# Altium project lab_2_pankov_boost.PrjPcb
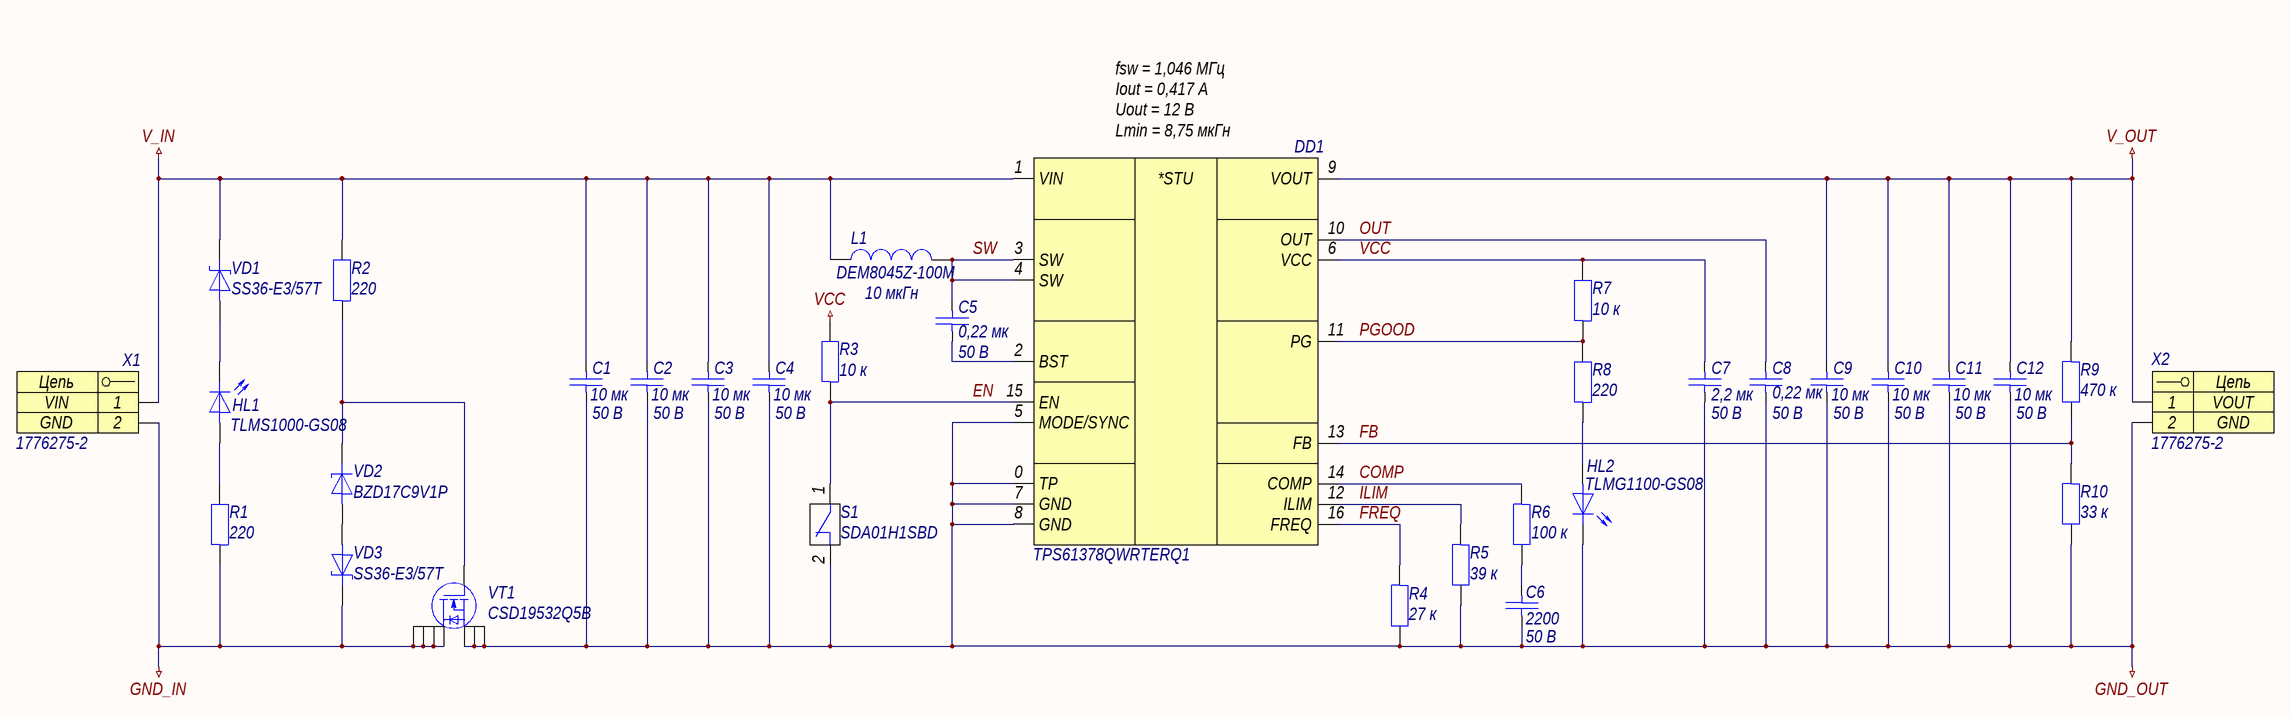
[diagram p0: lab_2_pankov_boost.SchDoc]
check: Капустин Д.А.; designation: СПБПУ.3331506.019; developer: Паньков И.С.; document_code: Ý3; document_type: Схема электрическая принципиальная; pcb_dec_number: СПБПУ.3331506.019; project: Преобразователь напряжения; sheets_total: 1; title: Лабораторная работа №2 — Преобразователь напряжения; title_line_1: Преобразователь; title_line_2: напряжения
1 sheet, 33 parts. Net scope: global (net labels, ports and power ports of the same name join across sheets).
Board file: lab_2_pankov_boost.PcbDoc

## Sheet lab_2_pankov_boost.SchDoc: Лабораторная работа №2 — Преобразователь напряжения
size 594 x 420 mm; CheckedBy: Капустин Д.А.; DrawnBy: Паньков И.С.; DocumentNumber: СПБПУ.3331506.019Ý3; SheetNumber: 1; SheetTotal: 1; DocumentCode: Ý3; ImagePath: СПБПУ.3331506.019

### Parts
C1  10 мк  Напряжение: 50 В  [C0805]
C2  10 мк  Напряжение: 50 В  [C0805]
C3  10 мк  Напряжение: 50 В  [C0805]
C4  10 мк  Напряжение: 50 В  [C0805]
C5  0,22 мк  Напряжение: 50 В  [C0603]
C6  2200  Напряжение: 50 В  [C0603]
C7  2,2 мк  Напряжение: 50 В  [C0603]
C8  0,22 мк  Напряжение: 50 В  [C0603]
C9  10 мк  Напряжение: 50 В  [C0805]
C10  10 мк  Напряжение: 50 В  [C0805]
C11  10 мк  Напряжение: 50 В  [C0805]
C12  10 мк  Напряжение: 50 В  [C0805]
DD1  TPS61378QWRTERQ1  [QFN-16-3X3]
HL1  TLMS1000-GS08  [HL0603]
HL2  TLMG1100-GS08  [HL0603]
L1  DEM8045Z-100M  Индуктивность: 10 мкГн  [DEM-2-800X800X450]
R1  220  [R0603]
R2  220  [R0603]
R3  10 к  [R0603]
R4  27 к  [R0603]
R5  39 к  [R0603]
R6  100 к  [R0603]
R7  10 к  [R0603]
R8  220  [R0603]
R9  470 к  [R0603]
R10  33 к  [R0603]
S1  SDA01H1SBD  [DIP-SWITCH-01-452X930X545]
VD1  SS36-E3/57T  [DO-214AB]
VD2  BZD17C9V1P  [DO-219AB]
VD3  SS36-E3/57T  [DO-214AB]
VT1  CSD19532Q5B  [SON-8]
X1  1776275-2  [1776275-2]
X2  1776275-2  [1776275-2]

### Nets
GND_IN: R1.1 VD3.1 VT1.D X1.2
GND_OUT: C1.2 C2.2 C3.2 C4.2 C6.1 C7.2 C8.2 C9.2 C10.2 C11.2 C12.2 DD1.0(TP) DD1.5(MODE/SYNC) DD1.7(GND) DD1.8(GND) HL2.1 R4.2 R5.2 R10.2 S1.2 VT1.S X2.2
V_IN: C1.1 C2.1 C3.1 C4.1 DD1.1(VIN) L1.1 R2.2 VD1.1 X1.1
V_OUT: C9.1 C10.1 C11.1 C12.1 DD1.9(VOUT) R9.1 X2.1
VCC: C7.1 DD1.6(VCC) R3.2 R7.2
COMP: DD1.14(COMP) R6.1
EN: DD1.15(EN) R3.1 S1.1
FB: DD1.13(FB) R9.2 R10.1
FREQ: DD1.16(FREQ) R4.1
ILIM: DD1.12(ILIM) R5.1
OUT: C8.1 DD1.10(OUT)
PGOOD: DD1.11(PG) R7.1 R8.2
SW: C5.1 DD1.3(SW) DD1.4(SW) L1.2
NetC5_2: C5.2 DD1.2(BST)
NetC6_2: C6.2 R6.2
NetHL1_1: HL1.1 VD1.2
NetHL1_2: HL1.2 R1.2
NetHL2_2: HL2.2 R8.1
NetR2_1: R2.1 VD2.1 VT1.G
NetVD2_2: VD2.2 VD3.2

### Notes on the sheet
- (near DD1) fsw = 1,046 МГц
  Iout = 0,417 А
  Uout = 12 В
  Lmin = 8,75 мкГн
- Перв. примен.
- Справ. №
- Подп. и дата
- Инв. № дубл.
- Нормоконтроль:
- Взам. инв. №
- Изм.
- Лист
- № докум.
- Подп.
- Дата
- Лит.
- Масса
- Масштаб
- Т.контр.
- Пров.
- Разраб.
- Листов
- Разработал:
- Инв. № подл.
- Н.контр.
- Утв.
- Копировал
- Формат
- А2
- (in symbol dd0001) *STU
- (in symbol x0005) Цепь

### Library data of the parts
C1-C4 C9-C12 = c0091: =Описание; ID: c0091; Фамилия: Паньков; Описание: Конденсатор чип 0805 10 мкФ 50 В ±10 %; Наименование: CC0805KRX5R9BB106; Производитель: YAGEO Corp.; Отклонение: ±10 %; Рабочие температуры: от –55 °С до +85 °С; Температурный коэффициент емкости: X5R; Корпус: 0805; Номинал: 10 мк; Номинальное напряжение: 50 В; HelpURL: https://www.yageo.com/upload/media/product/productsearch/datasheet/mlcc/UPY-GPHC_X5R_4V-to-50V_26.pdf
C5 C8 = c0041: =Описание; ID: c0041; Фамилия: Паньков; Описание: Конденсатор чип 0603 220 нФ 50 В ±10 %; Наименование: CC0603KRX5R9BB224; Производитель: YAGEO Corp.; Отклонение: ±10 %; Рабочие температуры: от –55 °С до +85 °С; Температурный коэффициент емкости: X5R; Корпус: 0603; Номинал: 0,22 мк; Номинальное напряжение: 50 В; HelpURL: https://www.yageo.com/upload/media/product/productsearch/datasheet/mlcc/UPY-GPHC_X5R_4V-to-50V_26.pdf
C6 = c0019: =Описание; ID: c0019; Фамилия: Паньков; Описание: Конденсатор чип 0603 2,2 нФ 50 В ±10 %; Наименование: CC0603KRX7R9BB222; Производитель: YAGEO Corp.; Отклонение: ±10 %; Рабочие температуры: от –55 °С до +125 °С; Температурный коэффициент емкости: X7R; Корпус: 0603; Номинал: 2200; Номинальное напряжение: 50 В; HelpURL: https://www.yageo.com/upload/media/product/products/datasheet/mlcc/UPY-GPHC_X7R_6.3V-to-50V_20.pdf
C7 = c0071: =Описание; ID: c0071; Фамилия: Самарин; Описание: Конденсатор чип 0603 2,2 мкФ 50 В ±10 %; Наименование: CC0603KRX5R9BB225; Производитель: YAGEO Corp.; Отклонение: ±10 %; Рабочие температуры: от –55 °С до +85 °С; Температурный коэффициент емкости: X5R; Корпус: 0603; Номинал: 2,2 мк; Номинальное напряжение: 50 В; HelpURL: https://www.yageo.com/upload/media/product/productsearch/datasheet/mlcc/UPY-GPHC_X5R_4V-to-50V_26.pdf
DD1 = dd0001: =Описание; ID: dd0001; Фамилия: Паньков; Описание: Повышающий преобразователь напряжения 18,5 В и 4,8 А; Производитель: Texas Instruments; Входное напряжение: от 2,3 В до 14 В; Выходное напряжение: от 4 В до 18,5 В; Коммутируемый ток: от 1 А до 4,8 А; Частота переключения: от 200 кГц до 2,2 МГц; Рабочие температуры: от -40 °С до +125 °С; Корпус: QFN-16 (3 x 3); Наименование: TPS61378QWRTERQ1; HelpURL: https://www.ti.com/product/TPS61378-Q1
HL1 = hl0001: =Описание; ID: hl0001; Фамилия: Ларионов; Описание: Светодиод чип 0603 красный; Производитель: Vishay Intertechnology, Inc.; Цвет: Red; Номинальная сила света: 4 мкд; Номинальная длина волны: 628 нм; Номинальный прямой ток: 15 мА; Номинальное падение напряжения: 1,8 В; Рассеиваемая мощность: 40 мВт; Рабочие температуры: от -40 °С до +100 °С; Корпус: 0603; Наименование: TLMS1000-GS08; HelpURL: https://www.vishay.com/leds/list/product-83172/
HL2 = hl0005: =Описание; ID: hl0005; Фамилия: Ларионов; Описание: Светодиод чип 0603 зеленый; Производитель: Vishay Intertechnology, Inc.; Цвет: Green; Номинальная сила света: 35 мкд; Номинальная длина волны: 570 нм; Номинальный прямой ток: 30 мА; Номинальное падение напряжения: 2,1 В; Рассеиваемая мощность: 90 мВт; Рабочие температуры: от -40 °С до +100 °С; Корпус: 0603; Наименование: TLMG1100-GS08; HelpURL: https://www.vishay.com/leds/list/product-83173/
L1 = l0005: =Описание; ID: l0005; Фамилия: Паньков; Описание: Катушка индуктивности 10 мкГн ±20 %; Производитель: Murata Manufacturing Co., Ltd.; Отклонение: ±20 %; Номинальное активное сопротивление: 33 мОм; Максимальное активное сопротивление: 39,6 мОм; Резонансная частота: 24 МГц; Номинальный ток (при нагреве на 20 °С/40 °С): 3,9 А; Ток насыщения: 4,3 А; Рабочее напряжение: не указано; Рабочие температуры: от –40 °С до +125 °С; Корпус: 8,0 x 8,0 x 4,5; Наименование: DEM8045Z-100M; Номинал: 10 мкГн; HelpURL: https://www.murata.com/en-us/products/productdetail?partno=DEM8045Z-100M%23
R1 R2 R8 = r0009: =Описание; ID: r0009; Фамилия: Ларионов; Описание: Резистор чип 0603 220 Ом ±1 % 0,1 Вт; Наименование: RC0603FR-07220RL; Производитель: YAGEO Corp.; Отклонение: ±1 %; Номинальное напряжение: 75 В; Рабочие температуры: от -55 °С до +155 °С; Номинальный ток: 1 А; Корпус: 0603; Номинал: 220; HelpURL: https://www.yageo.com/upload/media/product/productsearch/datasheet/rchip/PYu-RC_Group_51_RoHS_L_11.pdf
R3 R7 = r0013: =Описание; ID: r0013; Фамилия: Самарин; Описание: Резистор чип 0603 10 кОм ±1 % 0,1 Вт; Наименование: RC0603FR-0710KL; Производитель: YAGEO Corp.; Отклонение: ±1 %; Номинальное напряжение: 75 В; Рабочие температуры: от -55 °С до +155 °С; Номинальный ток: 1 А; Корпус: 0603; Номинал: 10 к; HelpURL: https://www.yageo.com/upload/media/product/productsearch/datasheet/rchip/PYu-RC_Group_51_RoHS_L_11.pdf
R4 = r0054: =Описание; ID: r0054; Фамилия: Паньков; Описание: Резистор чип 0603 27 кОм ±1 % 0,1 Вт; Наименование: RC0603FR-0727KL; Производитель: YAGEO Corp.; Отклонение: ±1 %; Номинальное напряжение: 75 В; Рабочие температуры: от -55 °С до +155 °С; Номинальный ток: 1 А; Корпус: 0603; Номинал: 27 к; HelpURL: https://www.yageo.com/upload/media/product/productsearch/datasheet/rchip/PYu-RC_Group_51_RoHS_L_11.pdf
R5 = r0058: =Описание; ID: r0058; Фамилия: Паньков; Описание: Резистор чип 0603 39 кОм ±1 % 0,1 Вт; Наименование: RC0603FR-0739KL; Производитель: YAGEO Corp.; Отклонение: ±1 %; Номинальное напряжение: 75 В; Рабочие температуры: от -55 °С до +155 °С; Номинальный ток: 1 А; Корпус: 0603; Номинал: 39 к; HelpURL: https://www.yageo.com/upload/media/product/productsearch/datasheet/rchip/PYu-RC_Group_51_RoHS_L_11.pdf
R6 = r0094: =Описание; ID: r0094; Фамилия: Водорезов; Описание: Резистор чип 0603 100 кОм ±1 % 0,1 Вт; Наименование: RC0603FR-07100KL; Производитель: YAGEO Corp.; Отклонение: ±1 %; Номинальное напряжение: 75 В; Рабочие температуры: от –55 °С до +155 °С; Номинальный ток: 1 А; Корпус: 0603; Номинал: 100 к; HelpURL: https://www.yageo.com/upload/media/product/productsearch/datasheet/rchip/PYu-RC_Group_51_RoHS_L_11.pdf
R9 = r0095: =Описание; ID: r0095; Фамилия: Паньков; Описание: Резистор чип 0603 470 кОм ±1 % 0,1 Вт; Наименование: RC0603FR-07470KL; Производитель: YAGEO Corp.; Отклонение: ±1 %; Номинальное напряжение: 75 В; Рабочие температуры: от -55 °С до +155 °С; Номинальный ток: 1 А; Корпус: 0603; Номинал: 470 к; HelpURL: https://www.yageo.com/upload/media/product/productsearch/datasheet/rchip/PYu-RC_Group_51_RoHS_L_11.pdf
R10 = r0056: =Описание; ID: r0056; Фамилия: Паньков; Описание: Резистор чип 0603 33 кОм ±1 % 0,1 Вт; Наименование: RC0603FR-0733KL; Производитель: YAGEO Corp.; Отклонение: ±1 %; Номинальное напряжение: 75 В; Рабочие температуры: от -55 °С до +155 °С; Номинальный ток: 1 А; Корпус: 0603; Номинал: 33 к; HelpURL: https://www.yageo.com/upload/media/product/productsearch/datasheet/rchip/PYu-RC_Group_51_RoHS_L_11.pdf
S1 = sw0002: =Описание; ID: sw0002; Фамилия: Паньков; Описание: 2-х позиционный движковый переключатель; Производитель: C&K; Ток нагрузки: 100 мА @ 5 В; Сопротивление контакта: 50 мОм; Количество контактов: 2; Рабочие температуры: от -40 °С до +85 °С; Промывка: Разрешена; Корпус: 4,52х9,30х5,45; Наименование: SDA01H1SBD; HelpURL: https://www.ckswitches.com/products/switches/product-details/DIP/SDA/SDA01H1SBD/
VD1 VD3 = vd0004: =Описание; ID: vd0004; Фамилия: Жернаков; Описание: Диод Шоттки 60 В 3 А; Производитель: Vishay Intertechnology, Inc.; Пиковое прямое напряжение: 0,75 В; Импульсное обратное напряжение: 60 В; Макс допустимый средний прямой ток: 3 А; Рабочие температуры: от –55 °С до +150 °С; Наименование: SS36-E3/57T; Корпус: DO-214AB; HelpURL: https://www.vishay.com/product?docid=88751
VD2 = vd0011: =Описание; ID: vd0011; Фамилия: Паньков; Описание: Стабилитрон 9,1 В; Производитель: Vishay Intertechnology, Inc.; Номинальное напряжение стабилизации: 9,1 В; Разброс напряжения стабилизации: 8,5...9,6 В; Номинальный ток стабилизации: 50 мА; Рабочие температуры: от –55 °С до +150 °С; Наименование: BZD17C9V1P; Корпус: DO-219AB; HelpURL: https://www.vishay.com/product?docid=85161
VT1 = vt0001: =Описание; ID: vt0001; Фамилия: Жернаков; Описание: Транзистор полевой N-канальный 100 В 17 А; Производитель: Texas Instruments; Напряжение затвор — исток: ±20 В; Напряжение сток — исток: 100 В; Ток стока: 17 А; Сопротивление сток — исток: 0,0057 Ом; Рабочие температуры: от –55 °С до +150 °С; Наименование: CSD19532Q5B; Корпус: SON-8; HelpURL: https://www.ti.com/lit/ds/symlink/csd19532q5b.pdf
X1 = x0005: =Описание; Contact_1: VIN; Contact_2: GND; ID: x0005; Фамилия: Паньков; Описание: Клеммная колодка с 2 выводами с шагом 3,5 мм; Производитель: TE Connectivity; Наименование: 1776275-2
X2 = x0005: =Описание; Contact_1: VOUT; Contact_2: GND; ID: x0005; Фамилия: Паньков; Описание: Клеммная колодка с 2 выводами с шагом 3,5 мм; Производитель: TE Connectivity; Наименование: 1776275-2